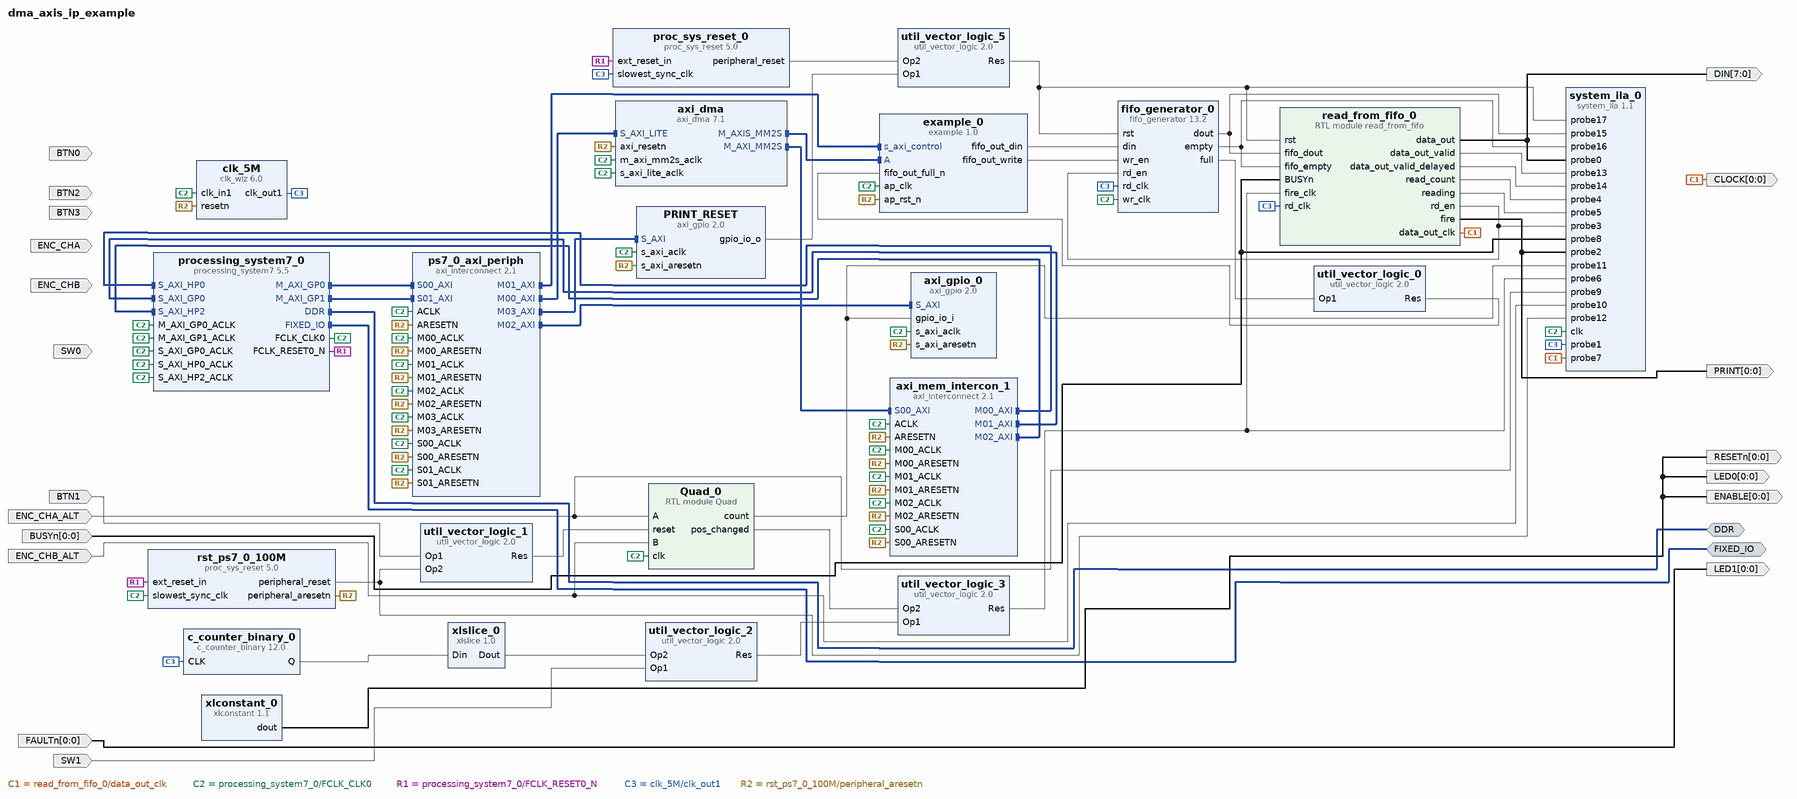
[diagram p0: block diagram of the top level]
# Vivado block design dma_axis_ip_example, xc7z020clg400-1, Vivado 2024.1
create_bd_design dma_axis_ip_example

create_bd_intf_port -mode Master -vlnv xilinx.com:interface:ddrx_rtl:1.0 DDR
create_bd_intf_port -mode Master -vlnv xilinx.com:display_processing_system7:fixedio_rtl:1.0 FIXED_IO
create_bd_port -dir O -from 0 -to 0 PRINT
create_bd_port -dir O -from 0 -to 0 RESETn
create_bd_port -dir O -from 0 -to 0 LED0
create_bd_port -dir O -from 0 -to 0 ENABLE
create_bd_port -dir O -from 7 -to 0 -type data DIN
create_bd_port -dir O -from 0 -to 0 -type clk CLOCK
create_bd_port -dir O -from 0 -to 0 LED1
create_bd_port -dir I -from 0 -to 0 BUSYn
create_bd_port -dir I -from 0 -to 0 FAULTn
create_bd_port -dir I ENC_CHA
create_bd_port -dir I ENC_CHB
create_bd_port -dir I BTN0
create_bd_port -dir I BTN1
create_bd_port -dir I SW0
create_bd_port -dir I BTN2
create_bd_port -dir I BTN3
create_bd_port -dir I SW1
create_bd_port -dir I ENC_CHB_ALT
create_bd_port -dir I ENC_CHA_ALT

create_bd_cell -type ip -vlnv xilinx.com:ip:axi_dma:7.1 axi_dma
set_property -dict [list \
  CONFIG.c_include_s2mm 0 \
  CONFIG.c_include_sg 0 \
  CONFIG.c_m_axi_mm2s_data_width 64 \
  CONFIG.c_m_axis_mm2s_tdata_width 32 \
  CONFIG.c_mm2s_burst_size 16 \
  CONFIG.c_sg_length_width 26 \
] [get_bd_cells axi_dma]
create_bd_cell -type ip -vlnv xilinx.com:ip:axi_interconnect:2.1 axi_mem_intercon_1
set_property -dict {CONFIG.ENABLE_ADVANCED_OPTIONS 1 CONFIG.NUM_MI 3 CONFIG.XBAR_DATA_WIDTH 64} [get_bd_cells axi_mem_intercon_1]
create_bd_cell -type ip -vlnv xilinx.com:ip:processing_system7:5.5 processing_system7_0
set_property -dict [list \
  CONFIG.PCW_APU_PERIPHERAL_FREQMHZ 650 \
  CONFIG.PCW_CRYSTAL_PERIPHERAL_FREQMHZ 50 \
  CONFIG.PCW_ENET0_ENET0_IO {MIO 16 .. 27} \
  CONFIG.PCW_ENET0_GRP_MDIO_ENABLE 1 \
  CONFIG.PCW_ENET0_GRP_MDIO_IO {MIO 52 .. 53} \
  CONFIG.PCW_ENET0_PERIPHERAL_ENABLE 1 \
  CONFIG.PCW_ENET0_RESET_ENABLE 1 \
  CONFIG.PCW_ENET0_RESET_IO {MIO 9} \
  CONFIG.PCW_ENET_RESET_ENABLE 1 \
  CONFIG.PCW_ENET_RESET_SELECT {Share reset pin} \
  CONFIG.PCW_FPGA0_PERIPHERAL_FREQMHZ 100 \
  CONFIG.PCW_FPGA1_PERIPHERAL_FREQMHZ 50 \
  CONFIG.PCW_GPIO_MIO_GPIO_ENABLE 1 \
  CONFIG.PCW_GPIO_MIO_GPIO_IO MIO \
  CONFIG.PCW_I2C_RESET_ENABLE 1 \
  CONFIG.PCW_PERIPHERAL_BOARD_PRESET part0 \
  CONFIG.PCW_PRESET_BANK1_VOLTAGE {LVCMOS 1.8V} \
  CONFIG.PCW_QSPI_GRP_FBCLK_ENABLE 1 \
  CONFIG.PCW_QSPI_GRP_FBCLK_IO {MIO 8} \
  CONFIG.PCW_QSPI_GRP_SINGLE_SS_ENABLE 1 \
  CONFIG.PCW_QSPI_GRP_SINGLE_SS_IO {MIO 1 .. 6} \
  CONFIG.PCW_QSPI_PERIPHERAL_ENABLE 1 \
  CONFIG.PCW_QSPI_QSPI_IO {MIO 1 .. 6} \
  CONFIG.PCW_SD0_GRP_CD_ENABLE 1 \
  CONFIG.PCW_SD0_GRP_CD_IO {MIO 47} \
  CONFIG.PCW_SD0_GRP_WP_ENABLE 0 \
  CONFIG.PCW_SD0_PERIPHERAL_ENABLE 1 \
  CONFIG.PCW_SD0_SD0_IO {MIO 40 .. 45} \
  CONFIG.PCW_SDIO_PERIPHERAL_FREQMHZ 50 \
  CONFIG.PCW_SINGLE_QSPI_DATA_MODE x4 \
  CONFIG.PCW_UART0_PERIPHERAL_ENABLE 1 \
  CONFIG.PCW_UART0_UART0_IO {MIO 14 .. 15} \
  CONFIG.PCW_UART1_PERIPHERAL_ENABLE 0 \
  CONFIG.PCW_UART_PERIPHERAL_FREQMHZ 100 \
  CONFIG.PCW_UIPARAM_DDR_BUS_WIDTH {16 Bit} \
  CONFIG.PCW_UIPARAM_DDR_FREQ_MHZ 525 \
  CONFIG.PCW_UIPARAM_DDR_PARTNO {MT41J256M16 RE-125} \
  CONFIG.PCW_USB0_PERIPHERAL_ENABLE 1 \
  CONFIG.PCW_USB0_RESET_ENABLE 1 \
  CONFIG.PCW_USB0_RESET_IO {MIO 46} \
  CONFIG.PCW_USB0_USB0_IO {MIO 28 .. 39} \
  CONFIG.PCW_USB_RESET_ENABLE 1 \
  CONFIG.PCW_USB_RESET_SELECT {Share reset pin} \
  CONFIG.PCW_USE_M_AXI_GP1 1 \
  CONFIG.PCW_USE_S_AXI_GP0 1 \
  CONFIG.PCW_USE_S_AXI_HP0 1 \
  CONFIG.PCW_USE_S_AXI_HP2 1 \
] [get_bd_cells processing_system7_0]
# 489 more settings of processing_system7_0 are not shown: defaults, MIO pin electricals, DDR timing, and values the tool derives
create_bd_cell -type ip -vlnv xilinx.com:ip:axi_interconnect:2.1 ps7_0_axi_periph
set_property -dict {CONFIG.NUM_MI 4 CONFIG.NUM_SI 2} [get_bd_cells ps7_0_axi_periph]
create_bd_cell -type ip -vlnv xilinx.com:ip:proc_sys_reset:5.0 rst_ps7_0_100M
create_bd_cell -type ip -vlnv xilinx.com:hls:example:1.0 example_0
create_bd_cell -type ip -vlnv xilinx.com:ip:clk_wiz:6.0 clk_5M
set_property -dict [list \
  CONFIG.CLKOUT1_JITTER 631.442 \
  CONFIG.CLKOUT1_PHASE_ERROR 346.848 \
  CONFIG.CLKOUT1_REQUESTED_OUT_FREQ 5 \
  CONFIG.MMCM_CLKFBOUT_MULT_F 32.000 \
  CONFIG.MMCM_CLKOUT0_DIVIDE_F 128.000 \
  CONFIG.MMCM_DIVCLK_DIVIDE 5 \
  CONFIG.RESET_PORT resetn \
  CONFIG.RESET_TYPE ACTIVE_LOW \
] [get_bd_cells clk_5M]
create_bd_cell -type ip -vlnv xilinx.com:ip:xlconstant:1.1 xlconstant_0
create_bd_cell -type ip -vlnv xilinx.com:ip:fifo_generator:13.2 fifo_generator_0
set_property -dict [list \
  CONFIG.Almost_Empty_Flag false \
  CONFIG.Almost_Full_Flag false \
  CONFIG.Fifo_Implementation Independent_Clocks_Block_RAM \
  CONFIG.Full_Flags_Reset_Value 0 \
  CONFIG.Input_Data_Width 8 \
  CONFIG.Performance_Options First_Word_Fall_Through \
  CONFIG.Programmable_Empty_Type No_Programmable_Empty_Threshold \
  CONFIG.Programmable_Full_Type No_Programmable_Full_Threshold \
  CONFIG.Reset_Pin true \
  CONFIG.Use_Embedded_Registers false \
  CONFIG.Use_Extra_Logic false \
] [get_bd_cells fifo_generator_0]
create_bd_cell -type ip -vlnv xilinx.com:ip:util_vector_logic:2.0 util_vector_logic_0
set_property -dict {CONFIG.C_OPERATION not CONFIG.C_SIZE 1} [get_bd_cells util_vector_logic_0]
create_bd_cell -type module -reference read_from_fifo read_from_fifo_0
create_bd_cell -type ip -vlnv xilinx.com:ip:proc_sys_reset:5.0 proc_sys_reset_0
create_bd_cell -type ip -vlnv xilinx.com:ip:c_counter_binary:12.0 c_counter_binary_0
create_bd_cell -type ip -vlnv xilinx.com:ip:xlslice:1.0 xlslice_0
set_property -dict {CONFIG.DIN_FROM 10 CONFIG.DIN_TO 10 CONFIG.DIN_WIDTH 16} [get_bd_cells xlslice_0]
create_bd_cell -type ip -vlnv xilinx.com:ip:system_ila:1.1 system_ila_0
set_property -dict [list \
  CONFIG.C_DATA_DEPTH 65536 \
  CONFIG.C_MON_TYPE NATIVE \
  CONFIG.C_NUM_OF_PROBES 18 \
  CONFIG.C_PROBE0_TYPE 0 \
  CONFIG.C_PROBE10_TYPE 0 \
  CONFIG.C_PROBE11_TYPE 0 \
  CONFIG.C_PROBE12_TYPE 0 \
  CONFIG.C_PROBE13_TYPE 0 \
  CONFIG.C_PROBE14_TYPE 0 \
  CONFIG.C_PROBE15_TYPE 0 \
  CONFIG.C_PROBE16_TYPE 0 \
  CONFIG.C_PROBE17_TYPE 0 \
  CONFIG.C_PROBE1_TYPE 0 \
  CONFIG.C_PROBE2_TYPE 0 \
  CONFIG.C_PROBE3_TYPE 0 \
  CONFIG.C_PROBE4_TYPE 0 \
  CONFIG.C_PROBE5_TYPE 0 \
  CONFIG.C_PROBE6_TYPE 0 \
  CONFIG.C_PROBE7_TYPE 0 \
  CONFIG.C_PROBE9_TYPE 0 \
] [get_bd_cells system_ila_0]
create_bd_cell -type ip -vlnv xilinx.com:ip:util_vector_logic:2.0 util_vector_logic_1
set_property -dict {CONFIG.C_OPERATION or CONFIG.C_SIZE 1} [get_bd_cells util_vector_logic_1]
create_bd_cell -type ip -vlnv xilinx.com:ip:axi_gpio:2.0 axi_gpio_0
set_property -dict {CONFIG.C_ALL_INPUTS 1} [get_bd_cells axi_gpio_0]
create_bd_cell -type module -reference Quad Quad_0
create_bd_cell -type ip -vlnv xilinx.com:ip:axi_gpio:2.0 PRINT_RESET
set_property -dict {CONFIG.C_ALL_OUTPUTS 1 CONFIG.C_GPIO_WIDTH 1} [get_bd_cells PRINT_RESET]
create_bd_cell -type ip -vlnv xilinx.com:ip:util_vector_logic:2.0 util_vector_logic_5
set_property -dict {CONFIG.C_OPERATION or CONFIG.C_SIZE 1} [get_bd_cells util_vector_logic_5]
create_bd_cell -type ip -vlnv xilinx.com:ip:util_vector_logic:2.0 util_vector_logic_2
set_property -dict {CONFIG.C_OPERATION and CONFIG.C_SIZE 1} [get_bd_cells util_vector_logic_2]
create_bd_cell -type ip -vlnv xilinx.com:ip:util_vector_logic:2.0 util_vector_logic_3
set_property -dict {CONFIG.C_OPERATION or} [get_bd_cells util_vector_logic_3]

# ---- connections ----

connect_bd_intf_net [get_bd_intf_pins example_0/A] [get_bd_intf_pins axi_dma/M_AXIS_MM2S]
connect_bd_intf_net [get_bd_intf_pins axi_dma/M_AXI_MM2S] [get_bd_intf_pins axi_mem_intercon_1/S00_AXI]
connect_bd_intf_net [get_bd_intf_pins axi_mem_intercon_1/M00_AXI] [get_bd_intf_pins processing_system7_0/S_AXI_HP0]
connect_bd_intf_net [get_bd_intf_pins axi_mem_intercon_1/M01_AXI] [get_bd_intf_pins processing_system7_0/S_AXI_GP0]
connect_bd_intf_net [get_bd_intf_pins axi_mem_intercon_1/M02_AXI] [get_bd_intf_pins processing_system7_0/S_AXI_HP2]
connect_bd_intf_net [get_bd_intf_ports DDR] [get_bd_intf_pins processing_system7_0/DDR]
connect_bd_intf_net [get_bd_intf_ports FIXED_IO] [get_bd_intf_pins processing_system7_0/FIXED_IO]
connect_bd_intf_net [get_bd_intf_pins processing_system7_0/M_AXI_GP0] [get_bd_intf_pins ps7_0_axi_periph/S00_AXI]
connect_bd_intf_net [get_bd_intf_pins processing_system7_0/M_AXI_GP1] [get_bd_intf_pins ps7_0_axi_periph/S01_AXI]
connect_bd_intf_net [get_bd_intf_pins axi_dma/S_AXI_LITE] [get_bd_intf_pins ps7_0_axi_periph/M00_AXI]
connect_bd_intf_net [get_bd_intf_pins ps7_0_axi_periph/M01_AXI] [get_bd_intf_pins example_0/s_axi_control]
connect_bd_intf_net [get_bd_intf_pins ps7_0_axi_periph/M02_AXI] [get_bd_intf_pins axi_gpio_0/S_AXI]
connect_bd_intf_net [get_bd_intf_pins ps7_0_axi_periph/M03_AXI] [get_bd_intf_pins PRINT_RESET/S_AXI]
connect_bd_net -net BTN1_1 [get_bd_ports BTN1] [get_bd_pins util_vector_logic_1/Op1]
connect_bd_net [get_bd_ports BUSYn] [get_bd_pins system_ila_0/probe8] [get_bd_pins read_from_fifo_0/BUSYn]
connect_bd_net -net ENC_CHA_1 [get_bd_ports ENC_CHA_ALT] [get_bd_pins system_ila_0/probe9] [get_bd_pins Quad_0/A]
connect_bd_net -net ENC_CHB_1 [get_bd_ports ENC_CHB_ALT] [get_bd_pins system_ila_0/probe10] [get_bd_pins Quad_0/B]
connect_bd_net [get_bd_ports FAULTn] [get_bd_ports LED1]
connect_bd_net -net Quad_0_count [get_bd_pins Quad_0/count] [get_bd_pins axi_gpio_0/gpio_io_i] [get_bd_pins system_ila_0/probe11]
connect_bd_net [get_bd_pins Quad_0/pos_changed] [get_bd_pins util_vector_logic_3/Op2]
connect_bd_net -net SW1_1 [get_bd_ports SW1] [get_bd_pins util_vector_logic_2/Op1]
connect_bd_net -net axi_gpio_1_gpio_io_o [get_bd_pins PRINT_RESET/gpio_io_o] [get_bd_pins util_vector_logic_5/Op1]
connect_bd_net [get_bd_pins c_counter_binary_0/Q] [get_bd_pins xlslice_0/Din]
connect_bd_net -net data_out [get_bd_pins read_from_fifo_0/data_out] [get_bd_pins system_ila_0/probe0] [get_bd_ports DIN]
connect_bd_net -net data_out_clk [get_bd_pins read_from_fifo_0/data_out_clk] [get_bd_pins system_ila_0/probe7] [get_bd_ports CLOCK]
connect_bd_net -net data_out_valid [get_bd_pins read_from_fifo_0/data_out_valid] [get_bd_pins system_ila_0/probe13]
connect_bd_net -net data_out_valid_delayed [get_bd_pins read_from_fifo_0/data_out_valid_delayed] [get_bd_pins system_ila_0/probe14]
connect_bd_net [get_bd_pins example_0/fifo_out_din] [get_bd_pins fifo_generator_0/din]
connect_bd_net [get_bd_pins example_0/fifo_out_write] [get_bd_pins fifo_generator_0/wr_en]
connect_bd_net -net fifo_generator_0_dout [get_bd_pins fifo_generator_0/dout] \
  [get_bd_pins system_ila_0/probe15] [get_bd_pins read_from_fifo_0/fifo_dout]
connect_bd_net -net fifo_generator_0_empty [get_bd_pins fifo_generator_0/empty] \
  [get_bd_pins system_ila_0/probe16] [get_bd_pins read_from_fifo_0/fifo_empty]
connect_bd_net [get_bd_pins fifo_generator_0/full] [get_bd_pins util_vector_logic_0/Op1]
connect_bd_net -net fire [get_bd_pins read_from_fifo_0/fire] [get_bd_pins system_ila_0/probe2] [get_bd_ports PRINT]
connect_bd_net [get_bd_pins proc_sys_reset_0/peripheral_reset] [get_bd_pins util_vector_logic_5/Op2]
connect_bd_net [get_bd_pins processing_system7_0/FCLK_CLK0] \
  [get_bd_pins axi_dma/m_axi_mm2s_aclk] [get_bd_pins axi_dma/s_axi_lite_aclk] [get_bd_pins axi_mem_intercon_1/ACLK] \
  [get_bd_pins axi_mem_intercon_1/M00_ACLK] [get_bd_pins axi_mem_intercon_1/S00_ACLK] \
  [get_bd_pins processing_system7_0/M_AXI_GP0_ACLK] [get_bd_pins processing_system7_0/S_AXI_HP0_ACLK] \
  [get_bd_pins processing_system7_0/S_AXI_HP2_ACLK] [get_bd_pins ps7_0_axi_periph/M00_ACLK] \
  [get_bd_pins ps7_0_axi_periph/S00_ACLK] [get_bd_pins rst_ps7_0_100M/slowest_sync_clk] \
  [get_bd_pins ps7_0_axi_periph/M01_ACLK] [get_bd_pins clk_5M/clk_in1] [get_bd_pins fifo_generator_0/wr_clk] \
  [get_bd_pins system_ila_0/clk] [get_bd_pins ps7_0_axi_periph/M02_ACLK] [get_bd_pins ps7_0_axi_periph/ACLK] \
  [get_bd_pins axi_gpio_0/s_axi_aclk] [get_bd_pins processing_system7_0/M_AXI_GP1_ACLK] \
  [get_bd_pins ps7_0_axi_periph/S01_ACLK] [get_bd_pins processing_system7_0/S_AXI_GP0_ACLK] \
  [get_bd_pins axi_mem_intercon_1/M01_ACLK] [get_bd_pins axi_mem_intercon_1/M02_ACLK] [get_bd_pins Quad_0/clk] \
  [get_bd_pins example_0/ap_clk] [get_bd_pins PRINT_RESET/s_axi_aclk] [get_bd_pins ps7_0_axi_periph/M03_ACLK]
connect_bd_net [get_bd_pins processing_system7_0/FCLK_RESET0_N] [get_bd_pins rst_ps7_0_100M/ext_reset_in] [get_bd_pins proc_sys_reset_0/ext_reset_in]
connect_bd_net -net rd_clk [get_bd_pins clk_5M/clk_out1] \
  [get_bd_pins fifo_generator_0/rd_clk] [get_bd_pins proc_sys_reset_0/slowest_sync_clk] [get_bd_pins c_counter_binary_0/CLK] \
  [get_bd_pins system_ila_0/probe1] [get_bd_pins read_from_fifo_0/rd_clk]
connect_bd_net -net rd_en [get_bd_pins read_from_fifo_0/rd_en] [get_bd_pins fifo_generator_0/rd_en] [get_bd_pins system_ila_0/probe3]
connect_bd_net -net read_count_state [get_bd_pins read_from_fifo_0/read_count] [get_bd_pins system_ila_0/probe4]
connect_bd_net -net reading_state [get_bd_pins read_from_fifo_0/reading] [get_bd_pins system_ila_0/probe5]
connect_bd_net [get_bd_pins rst_ps7_0_100M/peripheral_aresetn] \
  [get_bd_pins axi_dma/axi_resetn] [get_bd_pins axi_mem_intercon_1/ARESETN] [get_bd_pins axi_mem_intercon_1/M00_ARESETN] \
  [get_bd_pins axi_mem_intercon_1/S00_ARESETN] [get_bd_pins ps7_0_axi_periph/ARESETN] \
  [get_bd_pins ps7_0_axi_periph/M00_ARESETN] [get_bd_pins ps7_0_axi_periph/S00_ARESETN] \
  [get_bd_pins ps7_0_axi_periph/M01_ARESETN] [get_bd_pins clk_5M/resetn] [get_bd_pins ps7_0_axi_periph/M02_ARESETN] \
  [get_bd_pins axi_gpio_0/s_axi_aresetn] [get_bd_pins ps7_0_axi_periph/S01_ARESETN] \
  [get_bd_pins axi_mem_intercon_1/M01_ARESETN] [get_bd_pins axi_mem_intercon_1/M02_ARESETN] [get_bd_pins example_0/ap_rst_n] \
  [get_bd_pins PRINT_RESET/s_axi_aresetn] [get_bd_pins ps7_0_axi_periph/M03_ARESETN]
connect_bd_net -net rst_ps7_0_100M_peripheral_reset [get_bd_pins rst_ps7_0_100M/peripheral_reset] \
  [get_bd_pins system_ila_0/probe12] [get_bd_pins util_vector_logic_1/Op2]
connect_bd_net [get_bd_pins util_vector_logic_0/Res] [get_bd_pins example_0/fifo_out_full_n]
connect_bd_net [get_bd_pins util_vector_logic_1/Res] [get_bd_pins Quad_0/reset]
connect_bd_net [get_bd_pins util_vector_logic_2/Res] [get_bd_pins util_vector_logic_3/Op1]
connect_bd_net -net util_vector_logic_5_Res [get_bd_pins util_vector_logic_5/Res] \
  [get_bd_pins system_ila_0/probe17] [get_bd_pins fifo_generator_0/rst] [get_bd_pins read_from_fifo_0/rst]
connect_bd_net [get_bd_pins xlconstant_0/dout] [get_bd_ports ENABLE] [get_bd_ports LED0] [get_bd_ports RESETn]
connect_bd_net [get_bd_pins xlslice_0/Dout] [get_bd_pins util_vector_logic_2/Op2]
connect_bd_net -net xlslice_0_Dout1 [get_bd_pins util_vector_logic_3/Res] [get_bd_pins system_ila_0/probe6] [get_bd_pins read_from_fifo_0/fire_clk]
set_property HDL_ATTRIBUTE.DEBUG true [get_bd_nets ENC_CHA_1]
set_property HDL_ATTRIBUTE.MARK_DEBUG true [get_bd_nets ENC_CHA_1]
set_property HDL_ATTRIBUTE.DEBUG true [get_bd_nets ENC_CHB_1]
set_property HDL_ATTRIBUTE.MARK_DEBUG true [get_bd_nets ENC_CHB_1]
set_property HDL_ATTRIBUTE.DEBUG true [get_bd_nets Quad_0_count]
set_property HDL_ATTRIBUTE.MARK_DEBUG true [get_bd_nets Quad_0_count]
set_property HDL_ATTRIBUTE.DEBUG true [get_bd_nets data_out]
set_property HDL_ATTRIBUTE.MARK_DEBUG true [get_bd_nets data_out]
set_property HDL_ATTRIBUTE.DEBUG true [get_bd_nets data_out_clk]
set_property HDL_ATTRIBUTE.MARK_DEBUG true [get_bd_nets data_out_clk]
set_property HDL_ATTRIBUTE.DEBUG true [get_bd_nets data_out_valid]
set_property HDL_ATTRIBUTE.MARK_DEBUG true [get_bd_nets data_out_valid]
set_property HDL_ATTRIBUTE.DEBUG true [get_bd_nets data_out_valid_delayed]
set_property HDL_ATTRIBUTE.MARK_DEBUG true [get_bd_nets data_out_valid_delayed]
set_property HDL_ATTRIBUTE.DEBUG true [get_bd_nets fifo_generator_0_dout]
set_property HDL_ATTRIBUTE.MARK_DEBUG true [get_bd_nets fifo_generator_0_dout]
set_property HDL_ATTRIBUTE.DEBUG true [get_bd_nets fifo_generator_0_empty]
set_property HDL_ATTRIBUTE.MARK_DEBUG true [get_bd_nets fifo_generator_0_empty]
set_property HDL_ATTRIBUTE.DEBUG true [get_bd_nets fire]
set_property HDL_ATTRIBUTE.MARK_DEBUG true [get_bd_nets fire]
set_property HDL_ATTRIBUTE.DEBUG true [get_bd_nets rd_clk]
set_property HDL_ATTRIBUTE.MARK_DEBUG true [get_bd_nets rd_clk]
set_property HDL_ATTRIBUTE.DEBUG true [get_bd_nets read_count_state]
set_property HDL_ATTRIBUTE.MARK_DEBUG true [get_bd_nets read_count_state]
set_property HDL_ATTRIBUTE.DEBUG true [get_bd_nets reading_state]
set_property HDL_ATTRIBUTE.MARK_DEBUG true [get_bd_nets reading_state]
set_property HDL_ATTRIBUTE.DEBUG true [get_bd_nets rst_ps7_0_100M_peripheral_reset]
set_property HDL_ATTRIBUTE.MARK_DEBUG true [get_bd_nets rst_ps7_0_100M_peripheral_reset]
set_property HDL_ATTRIBUTE.DEBUG true [get_bd_nets util_vector_logic_5_Res]
set_property HDL_ATTRIBUTE.MARK_DEBUG true [get_bd_nets util_vector_logic_5_Res]

# ---- address map ----
assign_bd_address -offset 0x00000000 -range 512M -target_address_space [get_bd_addr_spaces axi_dma/Data_MM2S] [get_bd_addr_segs processing_system7_0/S_AXI_HP2/HP2_DDR_LOWOCM]
assign_bd_address -offset 0xFC000000 -range 16M -target_address_space [get_bd_addr_spaces axi_dma/Data_MM2S] [get_bd_addr_segs processing_system7_0/S_AXI_GP0/GP0_QSPI_LINEAR]
exclude_bd_addr_seg -offset 0x00000000 -range 1 -target_address_space [get_bd_addr_spaces axi_dma/Data_MM2S] [get_bd_addr_segs processing_system7_0/S_AXI_GP0/GP0_DDR_LOWOCM]
exclude_bd_addr_seg -offset 0x40000000 -range 1G -target_address_space [get_bd_addr_spaces axi_dma/Data_MM2S] [get_bd_addr_segs processing_system7_0/S_AXI_GP0/GP0_M_AXI_GP0]
exclude_bd_addr_seg -offset 0x80000000 -range 1G -target_address_space [get_bd_addr_spaces axi_dma/Data_MM2S] [get_bd_addr_segs processing_system7_0/S_AXI_GP0/GP0_M_AXI_GP1]
exclude_bd_addr_seg -offset 0xE0000000 -range 4M -target_address_space [get_bd_addr_spaces axi_dma/Data_MM2S] [get_bd_addr_segs processing_system7_0/S_AXI_GP0/GP0_IOP]
assign_bd_address -offset 0x00000000 -range 512M -target_address_space [get_bd_addr_spaces axi_dma/Data_S2MM] [get_bd_addr_segs processing_system7_0/S_AXI_HP0/HP0_DDR_LOWOCM]
assign_bd_address -offset 0x40000000 -range 64K -target_address_space [get_bd_addr_spaces processing_system7_0/Data] [get_bd_addr_segs example_0/s_axi_control/Reg]
assign_bd_address -offset 0x40010000 -range 64K -target_address_space [get_bd_addr_spaces processing_system7_0/Data] [get_bd_addr_segs axi_gpio_0/S_AXI/Reg]
assign_bd_address -offset 0x40400000 -range 64K -target_address_space [get_bd_addr_spaces processing_system7_0/Data] [get_bd_addr_segs axi_dma/S_AXI_LITE/Reg]
assign_bd_address -offset 0x7FFF8000 -range 32K -target_address_space [get_bd_addr_spaces processing_system7_0/Data] [get_bd_addr_segs PRINT_RESET/S_AXI/Reg]
assign_bd_address -offset 0x80000000 -range 32K -target_address_space [get_bd_addr_spaces processing_system7_0/Data] [get_bd_addr_segs PRINT_RESET/S_AXI/Reg]

set_property USER_COMMENTS.comment_0 {Button 0 fires printhead while pressed. 
Button 1 resets encoder position
SW0 enables the encoder clock signal} [current_bd_design]

validate_bd_design
save_bd_design
